# EAGLE schematic piezo-preamp-tickler_V2-RevC (EAGLE 8.2.1)

## Sheet 1 of 2
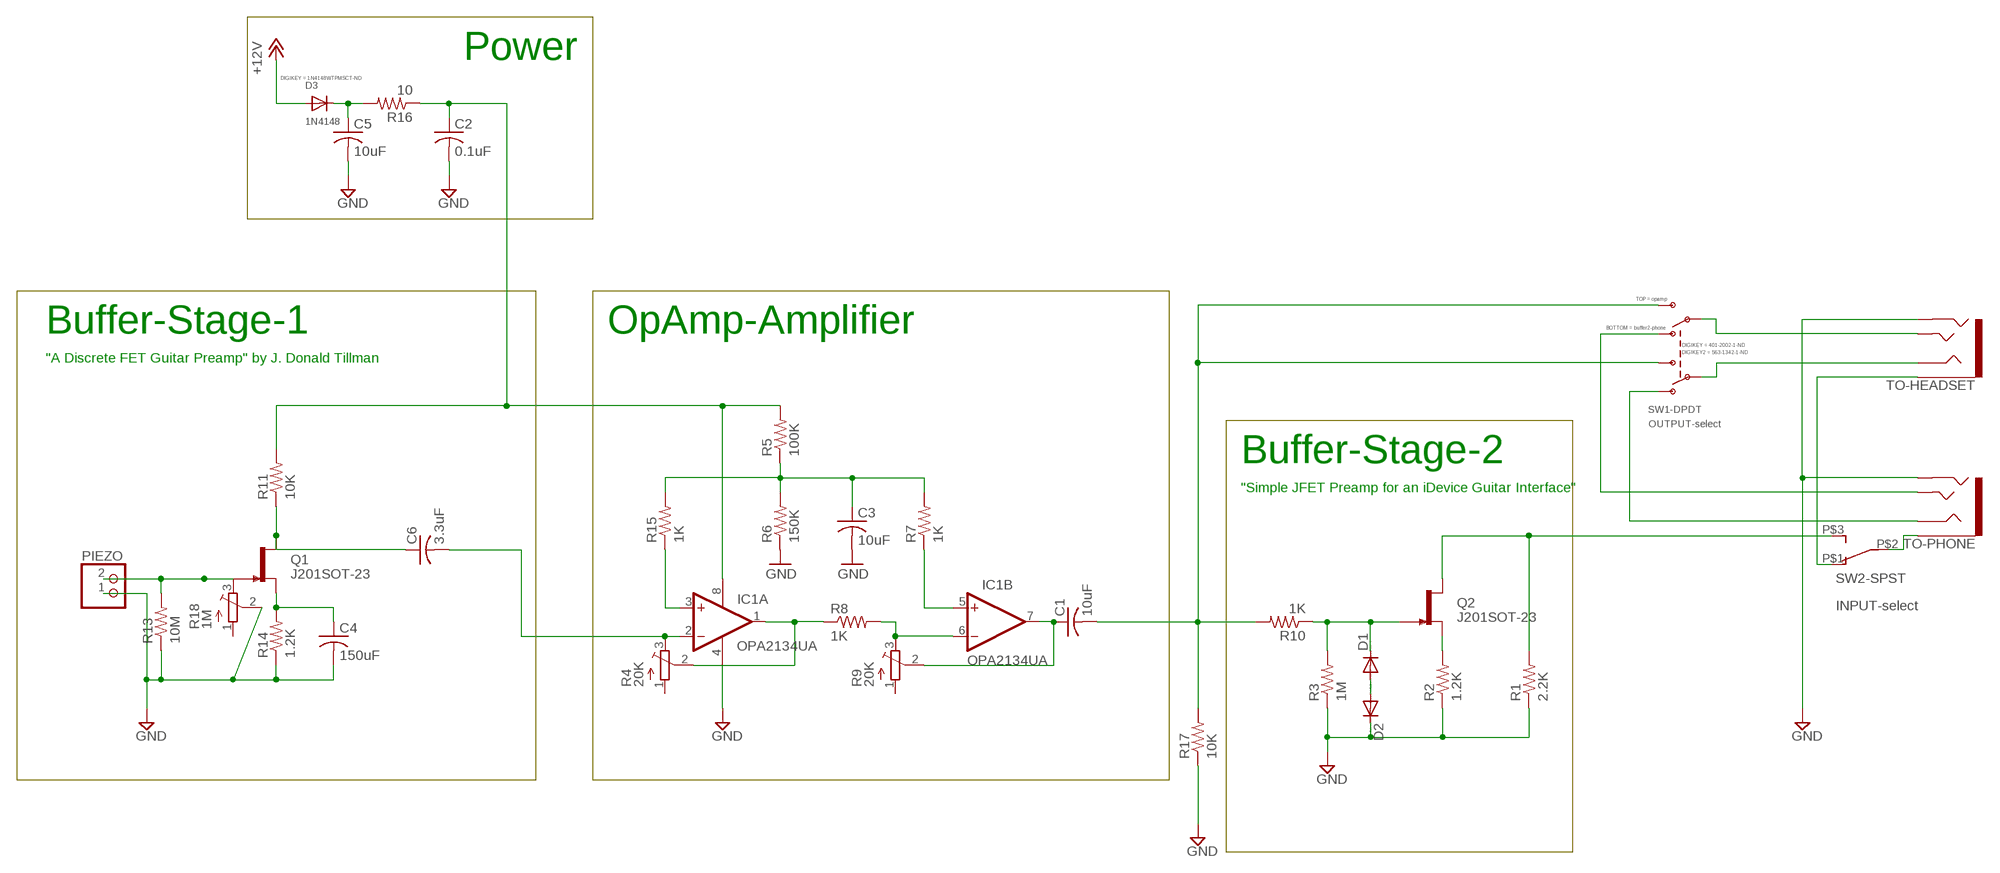
[diagram p0: schematic, sheet 1]

### Parts
C1  10uF  C-USC0805K  [C0805K]
C2  0.1uF  C-USC0805K  [C0805K]
C3  10uF  C-USC0805K  [C0805K]
C4  150uF  C-US050-024X044  [C050-024X044]
C5  10uF  C-USC0805K  [C0805K]
C6  3.3uF  C-USC0805K  [C0805K]
D1  DIODE-SOD123  [SOD123]
D2  DIODE-SOD123  [SOD123]
D3  1N4148  DIODESOD-123  [SOD-123]
IC1  OPA2134UA  [SO08]
PIEZO  JST_2PIN-THM  [JST-PH-2-THM]
Q1  J201SOT-23  [SOT23-3]
Q2  J201SOT-23  [SOT23-3]
R1  2.2K  R-US_R0603  [R0603]
R2  1.2K  R-US_R0603  [R0603]
R3  1M  R-US_R0603  [R0603]
R4  20K  TRIMPOTTC33X  [TC33X]
R5  100K  R-US_R0603  [R0603]
R6  150K  R-US_R0603  [R0603]
R7  1K  R-US_R0603  [R0603]
R8  1K  R-US_R0603  [R0603]
R9  20K  TRIMPOTTC33X  [TC33X]
R10  1K  R-US_R0603  [R0603]
R11  10K  R-US_R0603  [R0603]
R13  10M  R-US_R0603  [R0603]
R14  1.2K  R-US_R0603  [R0603]
R15  1K  R-US_R0603  [R0603]
R16  10  R-US_R0603  [R0603]
R17  10K  R-US_R0603  [R0603]
R18  1M  TRIMPOTTC33X  [TC33X]
SW1-DPDT  OUTPUT-select  SWITCH_DPDT  [DPDT_SMT_JS202011SCQN]
SW2-SPST  INPUT-select  SWITCH_SPDTCL-SB-12B  [SWITCH_SPDT_CL-SB-12B]
TO-HEADSET  AUDIO-JACK3LGPADS  [AUDIO-JACK-TRRS-SMD]
TO-PHONE  AUDIO-JACK3LGPADS  [AUDIO-JACK-TRRS-SMD]

### Nets
+12V: D3.A ; also sheet 2
GND: C2.2 C3.2 C4.2 C5.2 D2.C IC1.4(A:V-) PIEZO.1 R1.1 R2.1 R3.1 R6.1 R13.1 R14.1 R17.1 R18.2(S) TO-HEADSET.RING2 TO-PHONE.RING2 ; also sheet 2
N$1: D1.A D2.A
N$2: PIEZO.2 Q1.3(G) R13.2 R18.3(E)
N$3: Q2.2(S) R2.2
N$5: IC1.5(B:+IN) R7.1
N$6: C1.1 IC1.7(B:OUT) R9.2(S)
N$7: IC1.6(B:-IN) R8.2 R9.3(E)
N$9: C6.1 Q1.1(D) R11.1
N$10: D1.C Q2.3(G) R3.2 R10.1
N$11: C1.2 R10.2 R17.2 SW1-DPDT.P$3(S1) SW1-DPDT.P$4(S2)
N$12: SW2-SPST.P$1 TO-HEADSET.EARTH
N$13: SW1-DPDT.P$5(P2) TO-HEADSET.TIP
N$14: C4.1 Q1.2(S) R14.2
N$15: SW1-DPDT.P$2(P1) TO-HEADSET.RING1
N$16: C5.1 D3.C R16.2
N$17: SW2-SPST.P$2 TO-PHONE.EARTH
N$22: IC1.3(A:+IN) R15.1
N$23: C3.1 R5.1 R6.2 R7.2 R15.2
N$24: IC1.1(A:OUT) R4.2(S) R8.1
N$25: C2.1 IC1.8(A:V+) R5.2 R11.2 R16.1
N$26: SW1-DPDT.P$1(O1) TO-PHONE.RING1
N$27: SW1-DPDT.P$6(O2) TO-PHONE.TIP
N$28: C6.2 IC1.2(A:-IN) R4.3(E)
SELECT: Q2.1(D) R1.2 SW2-SPST.P$3
Unconnected: R4.1(A) R9.1(A) R18.1(A)

### Notes on the sheet
- Power
- Buffer-Stage-1 | OpAmp-Amplifier
- "A Discrete FET Guitar Preamp" by J. Donald Tillman
- Buffer-Stage-2
- "Simple JFET Preamp for an iDevice Guitar Interface"

## Sheet 2 of 2
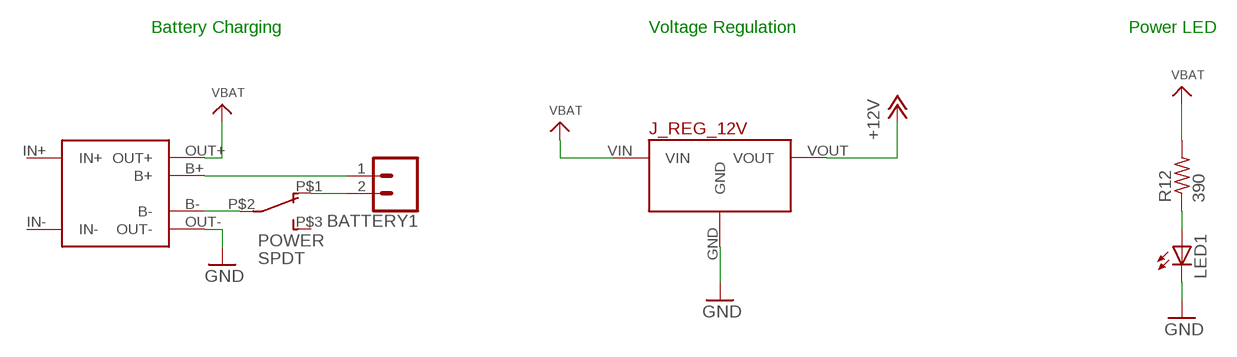
[diagram p1: schematic, sheet 2]

### Parts
BATTERY1  CONN_02LOCK  [1X02_LOCK]
J_REG_12V  POLOLU_VOLTAGE_REGULATORS_3PIN  [POLOLU_5V-12V_STEPUP_U3V12F5-U3V12F12]
LED1  LED3MM  [LED3MM]
POWER  SPDT  SWITCH_SPDTCL-SB-12B  [SWITCH_SPDT_CL-SB-12B]
R12  390  R-US_R0805  [R0805]
USB-LIPO-CHARGER  TP4056-MODULE  [TP4056-LITHIUM-PROTECTED-MODULE]

### Nets
+12V: J_REG_12V.VOUT ; also sheet 1
GND: J_REG_12V.GND LED1.K(C) USB-LIPO-CHARGER.OUT- ; also sheet 1
N$18: LED1.A R12.1
N$19: BATTERY1.1 USB-LIPO-CHARGER.B+
N$20: POWER.P$2 USB-LIPO-CHARGER.B-
N$21: BATTERY1.2 POWER.P$1
VBAT: J_REG_12V.VIN R12.2 USB-LIPO-CHARGER.OUT+
Unconnected: POWER.P$3

### Notes on the sheet
- Battery Charging | Voltage Regulation | Power LED

## Power pins joined to a net without a drawn wire
IN+: USB-LIPO-CHARGER.IN+
IN-: USB-LIPO-CHARGER.IN-

## Library data of the parts
BATTERY1 = SparkFun-Connectors:CONN_02: Multi connection point. Often used as Generic Header-pin footprint for 0.1 inch spaced/style header connections On any of the 0.1 inch spaced packages, you can populate with these: Break Away Headers - Straight <https://www.sparkfun.com/products/116> (PRT-00116) Break Away Male Headers - Right Angle <https://www.sparkfun.com/products/553> (PRT-00553) Female Headers <https://www.sparkfun.com/products/115> (PRT-00115) Break Away Headers - Machine Pin <https://www.sparkfun.com/products/117> (PRT-00117) Break Away Female Headers - Swiss Machine Pin <https://www.sparkfun.com/products/743> (PRT-00743) For SCREWTERMINALS and SPRING TERMINALS visit here: Screw Terimnals on SparkFun.com <https://www.sparkfun.com/search/results?term=Screw+Terminals> (5mm/3.5mm/2.54mm spacing) This device is also useful as a general connection point to wire up your design to another part of your project. Our various solder wires solder well into these plated through hole pads. Hook-Up Wire - Assortment (Stranded, 22 AWG) <https://www.sparkfun.com/products/11375> (PRT-11375) Hook-Up Wire - Assortment (Solid Core, 22 AWG) <https://www.sparkfun.com/products/11367> (PRT-11367) View the entire wire category on our website here <https://www.sparkfun.com/categories/141> Special notes: Molex polarized connector foot print use with: PRT-08233 with associated crimp pins and housings. 2.54_SCREWTERM for use with PRT-10571. 3.5mm Screw Terminal footprints for PRT-08084 5mm Screw Terminal footprints for use with PRT-08432
C1-C6 = adafruit:C-US: CAPACITOR, American symbol
D1 D2 = diode:DIODE-: DIODE
D3 = adafruit:DIODE: Diode SMADIODE - SMA Surface Mount Package 20V 1A Schottky Diode Digikey: 641-1014-6-ND DO-1N4148 - Through Hole Small Current Diode SOD-123 20V 1 A (.5mV Vf) Schottky Diode - Digikey: MBRX120TPMSCT-ND SOD-323 10V 570mA (.38mV Vf, 3ns) Schottky Diode - Digikey: ZLLS410CT-ND SOD-523 30V 30mA Schottky Diode (RB751S-40TE61) - Digikey: RB751S-40TE61CT-ND SOT23-R/W - SOT23 Package (R = Solder Paste/Reflow Ovens, W = Hand-Soldering) BAT54Film 40V 300mA - Digikey: 497-7162-1-ND; DIGIKEY: 1N4148WTPMSCT-ND
IC1 = linear:OPA2*: Dual Operational Amplifier Low Power, Single-Supply, Rail-To-Rail Operational Amplifier Source: http://focus.ti.com/lit/ds/symlink/opa2345.pdf http://focus.ti.com .. opa241.pdf http://focus.ti.com/lit/ds/symlink/opa2134.pdf
J_REG_12V = CMU-ArtFab:POLOLU_VOLTAGE_REGULATORS_3PIN: Polulu 5V Step-Up/Step-Down Voltage REgulator S7V7F5
LED1 = led:LED: LED OSRAM: - CHIPLED LG R971, LG N971, LY N971, LG Q971, LY Q971, LO R971, LY R971 LH N974, LH R974 LS Q976, LO Q976, LY Q976 LO Q996 - Hyper CHIPLED LW Q18S LB Q993, LB Q99A, LB R99A - SideLED LS A670, LO A670, LY A670, LG A670, LP A670 LB A673, LV A673, LT A673, LW A673 LH A674 LY A675 LS A676, LA A676, LO A676, LY A676, LW A676 LS A679, LY A679, LG A679 - Hyper Micro SIDELED® LS Y876, LA Y876, LO Y876, LY Y876 LT Y87S - SmartLED LW L88C, LW L88S LB L89C, LB L89S, LG L890 LS L89K, LO L89K, LY L89K LS L896, LA L896, LO L896, LY L896 - TOPLED LS T670, LO T670, LY T670, LG T670, LP T670 LSG T670, LSP T670, LSY T670, LOP T670, LYG T670 LG T671, LOG T671, LSG T671 LB T673, LV T673, LT T673, LW T673 LH T674 LS T676, LA T676, LO T676, LY T676, LB T676, LH T676, LSB T676, LW T676 LB T67C, LV T67C, LT T67C, LS T67K, LO T67K, LY T67K, LW E67C LS E67B, LA E67B, LO E67B, LY E67B, LB E67C, LV E67C, LT E67C LW T67C LS T679, LY T679, LG T679 LS T770, LO T770, LY T770, LG T770, LP T770 LB T773, LV T773, LT T773, LW T773 LH T774 LS E675, LA E675, LY E675, LS T675 LS T776, LA T776, LO T776, LY T776, LB T776 LHGB T686 LT T68C, LB T68C - Hyper Mini TOPLED® LB M676 - Mini TOPLED Santana® LG M470 LS M47K, LO M47K, LY M47K Source: http://www.osram.convergy.de LUXEON: - LUMILED® LXK2-PW12-R00, LXK2-PW12-S00, LXK2-PW14-U00, LXK2-PW14-V00 LXK2-PM12-R00, LXK2-PM12-S00, LXK2-PM14-U00 LXK2-PE12-Q00, LXK2-PE12-R00, LXK2-PE12-S00, LXK2-PE14-T00, LXK2-PE14-U00 LXK2-PB12-K00, LXK2-PB12-L00, LXK2-PB12-M00, LXK2-PB14-N00, LXK2-PB14-P00, LXK2-PB14-Q00 LXK2-PR12-L00, LXK2-PR12-M00, LXK2-PR14-Q00, LXK2-PR14-R00 LXK2-PD12-Q00, LXK2-PD12-R00, LXK2-PD12-S00 LXK2-PH12-R00, LXK2-PH12-S00 LXK2-PL12-P00, LXK2-PL12-Q00, LXK2-PL12-R00 Source: www.luxeon.com KINGBRIGHT: KA-3528ASYC Source: www.kingbright.com
PIEZO = adafruit:JST_2PIN: JST 2-Pin Connectors of various flavors SMT-RA (S2B-PH-SM4) 4UConnector #17311 SMT (B2B-PH-SM4) THM-RA (S2B-PH) THM (B2B-PH)
POWER SW2-SPST = CMU-ArtFab:SWITCH_SPDT
Q1 Q2 = CMU-ArtFab:J201: N-channel JFET
R1-R3 R5-R8 R10-R17 = CMU-ArtFab:R-US_: RESISTOR, American symbol
R4 R9 R18 = adafruit:TRIMPOT: SMT trimmer potentiometer part number TC33X http://www.ladyada.net/library/eagle
SW1-DPDT = microbuilder:SWITCH_DPDT: Switch - DPDT A DPDT Switch acts like an SPDT switch, but has a pair of switches instead of just one. Vertical - 0.3A @ 6V SMT - Digikey: JS202011SCQN; BOTTOM: buffer2-phone; DIGIKEY: 401-2002-1-ND; DIGIKEY2: 563-1342-1-ND; TOP: opamp
TO-HEADSET TO-PHONE = Daniel:AUDIO-JACK3: Audio jack - 3.5mm TRRS variety - two rings.
USB-LIPO-CHARGER = CMU-ArtFab:TP4056-MODULE

## Net classes
0 default: width 0.152 mm, clearance 0.2 mm